# Altium schematic sheet CurrentSense.SchDoc
size A
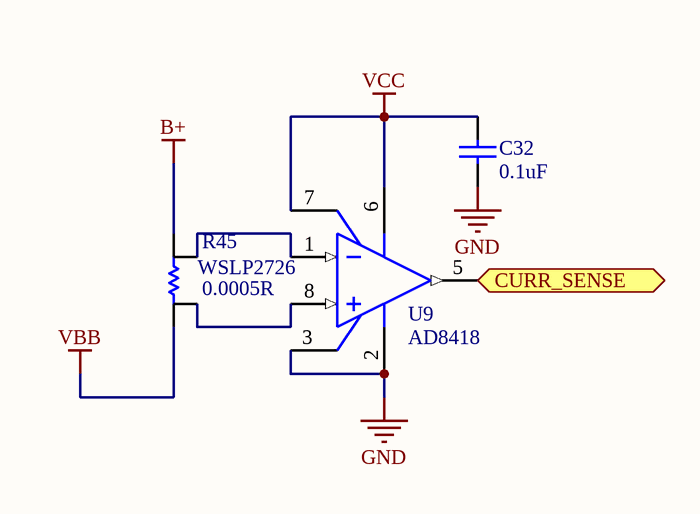
[diagram p0: CurrentSense.SchDoc]

## Parts
C32  value 0.1uF  [C0402[1005X55]]  (hidden comment: 0.1uF 6.3V 0402)
R45  WSLP2726  value 0.0005R  [WSL2726]
U9  AD8418  [MSOP-8]

## Ports
CURR_SENSE (out)

## Nets
B+: R45.2
GND: C32.1 U9.2(GND) U9.3(VREF2)
VBB: R45.1
VCC: C32.2 U9.6(VS) U9.7(VREF1)
CURR_SENSE: U9.5(OUT) ; port CURR_SENSE
NetR45_3: R45.3 U9.8(IN+)
NetR45_4: R45.4 U9.1(IN-)

## Library data of the parts
C32 = CAP_0.1uF_6.3V_0402_10%: 0.1uF 6.3V 10% 0402 (1005 Metric); PartNumber: GRM155R70J104KA01D; Manufacturer: Murata; Tolerance: 10%; Mounting Technology: Surface Mount; PackageReference: 0402; PackageDescription: 0402 (1005 Metric); Voltage: 6.3V
R45 = WSLP2726: Resistor; Published: 8-Jun-2000; LatestRevisionDate: 17-Jul-2002; LatestRevisionNote: Re-released for DXP Platform.; PackageReference: AXIAL-0.3; Publisher: Altium Limited; PackageDescription: Axial Device, Thru-Hole; 2 Leads; 0.3 in Pin Spacing